# Altium schematic sheet 无线门禁系统.SchDoc
size A2
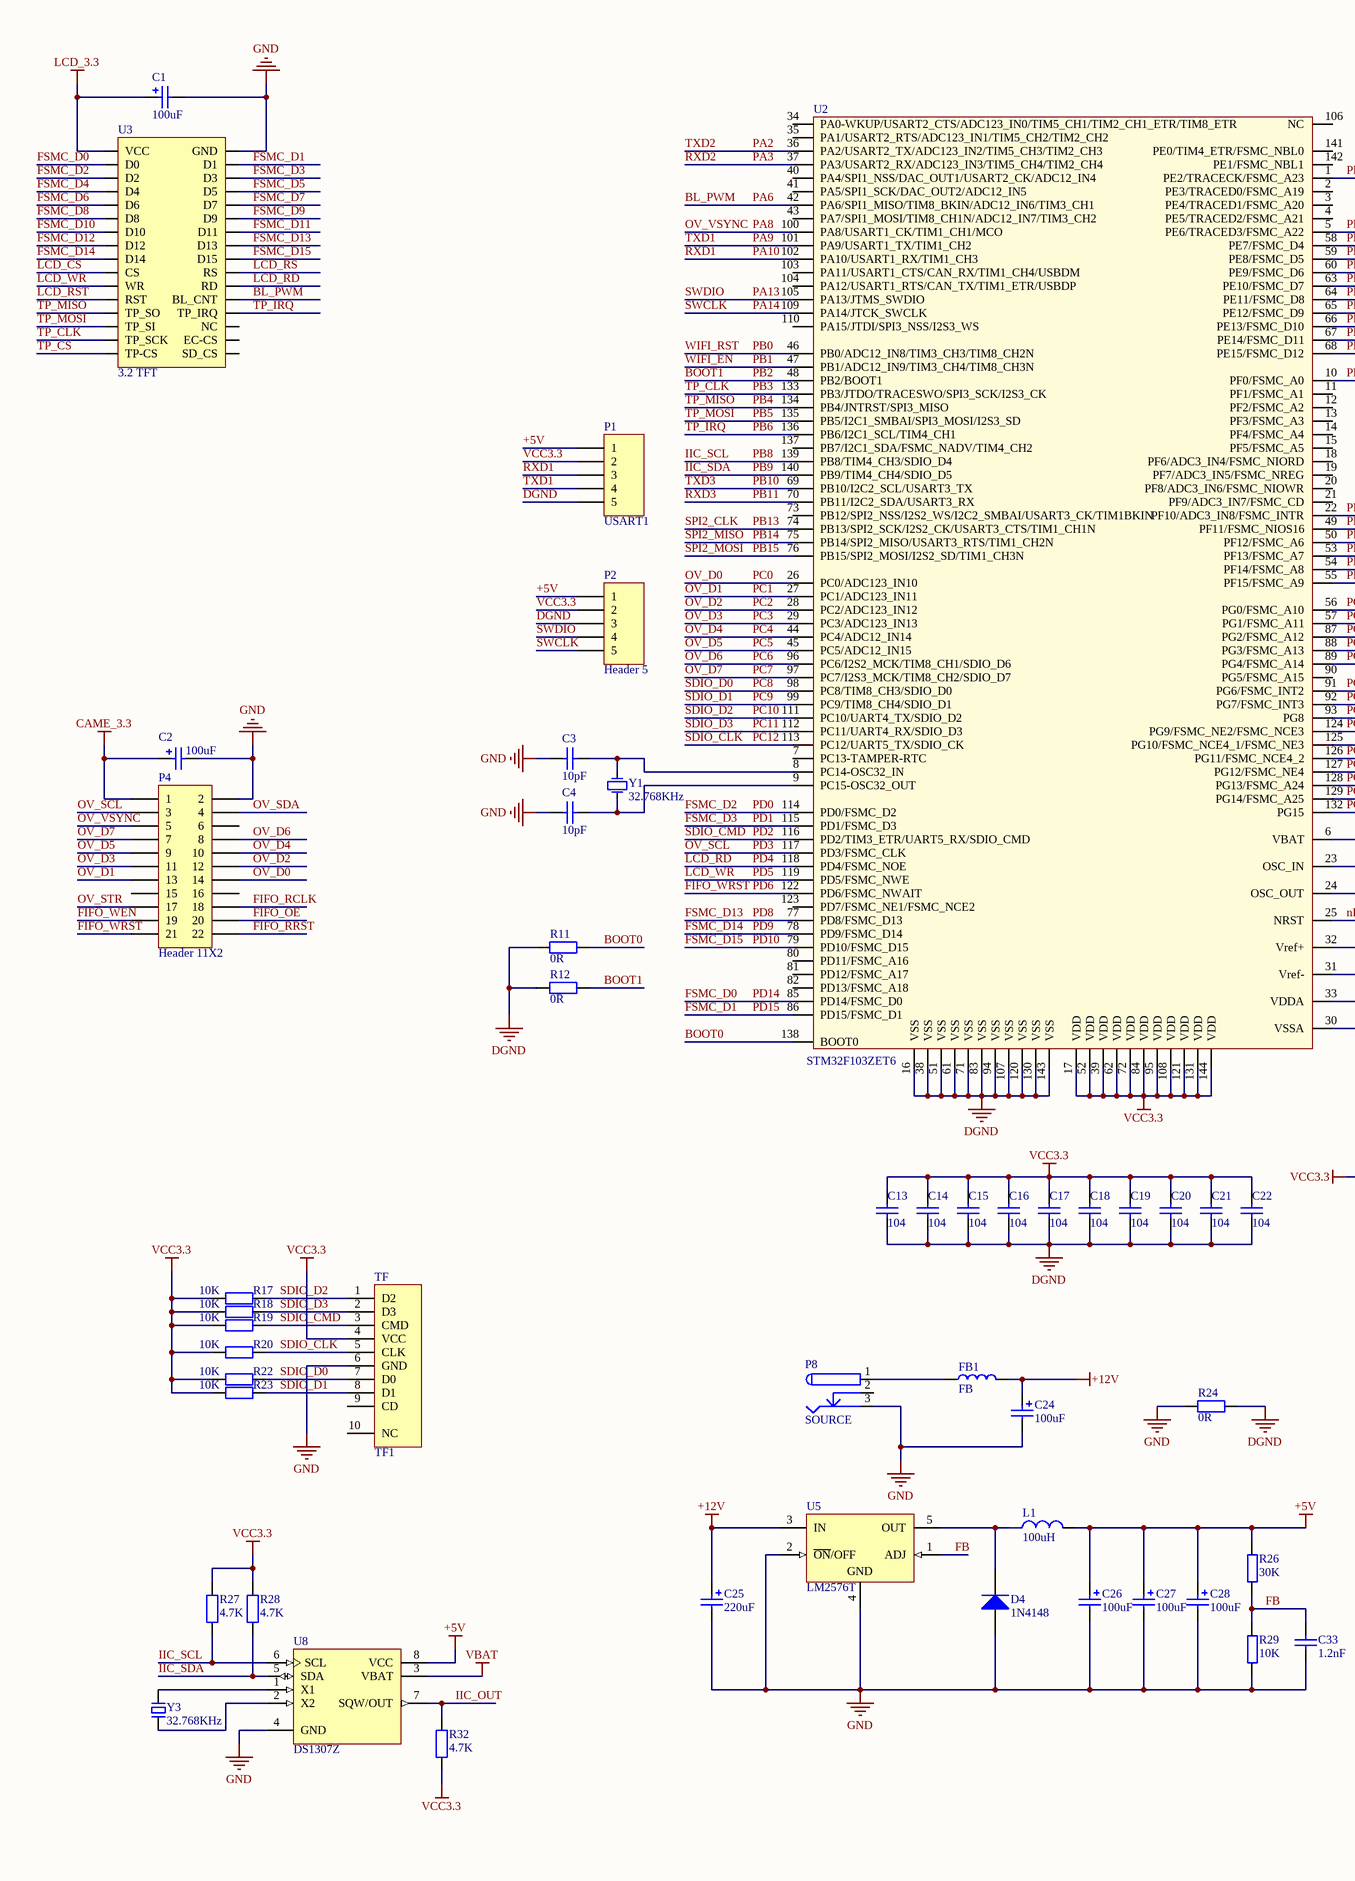
[diagram p0: 无线门禁系统.SchDoc, left]
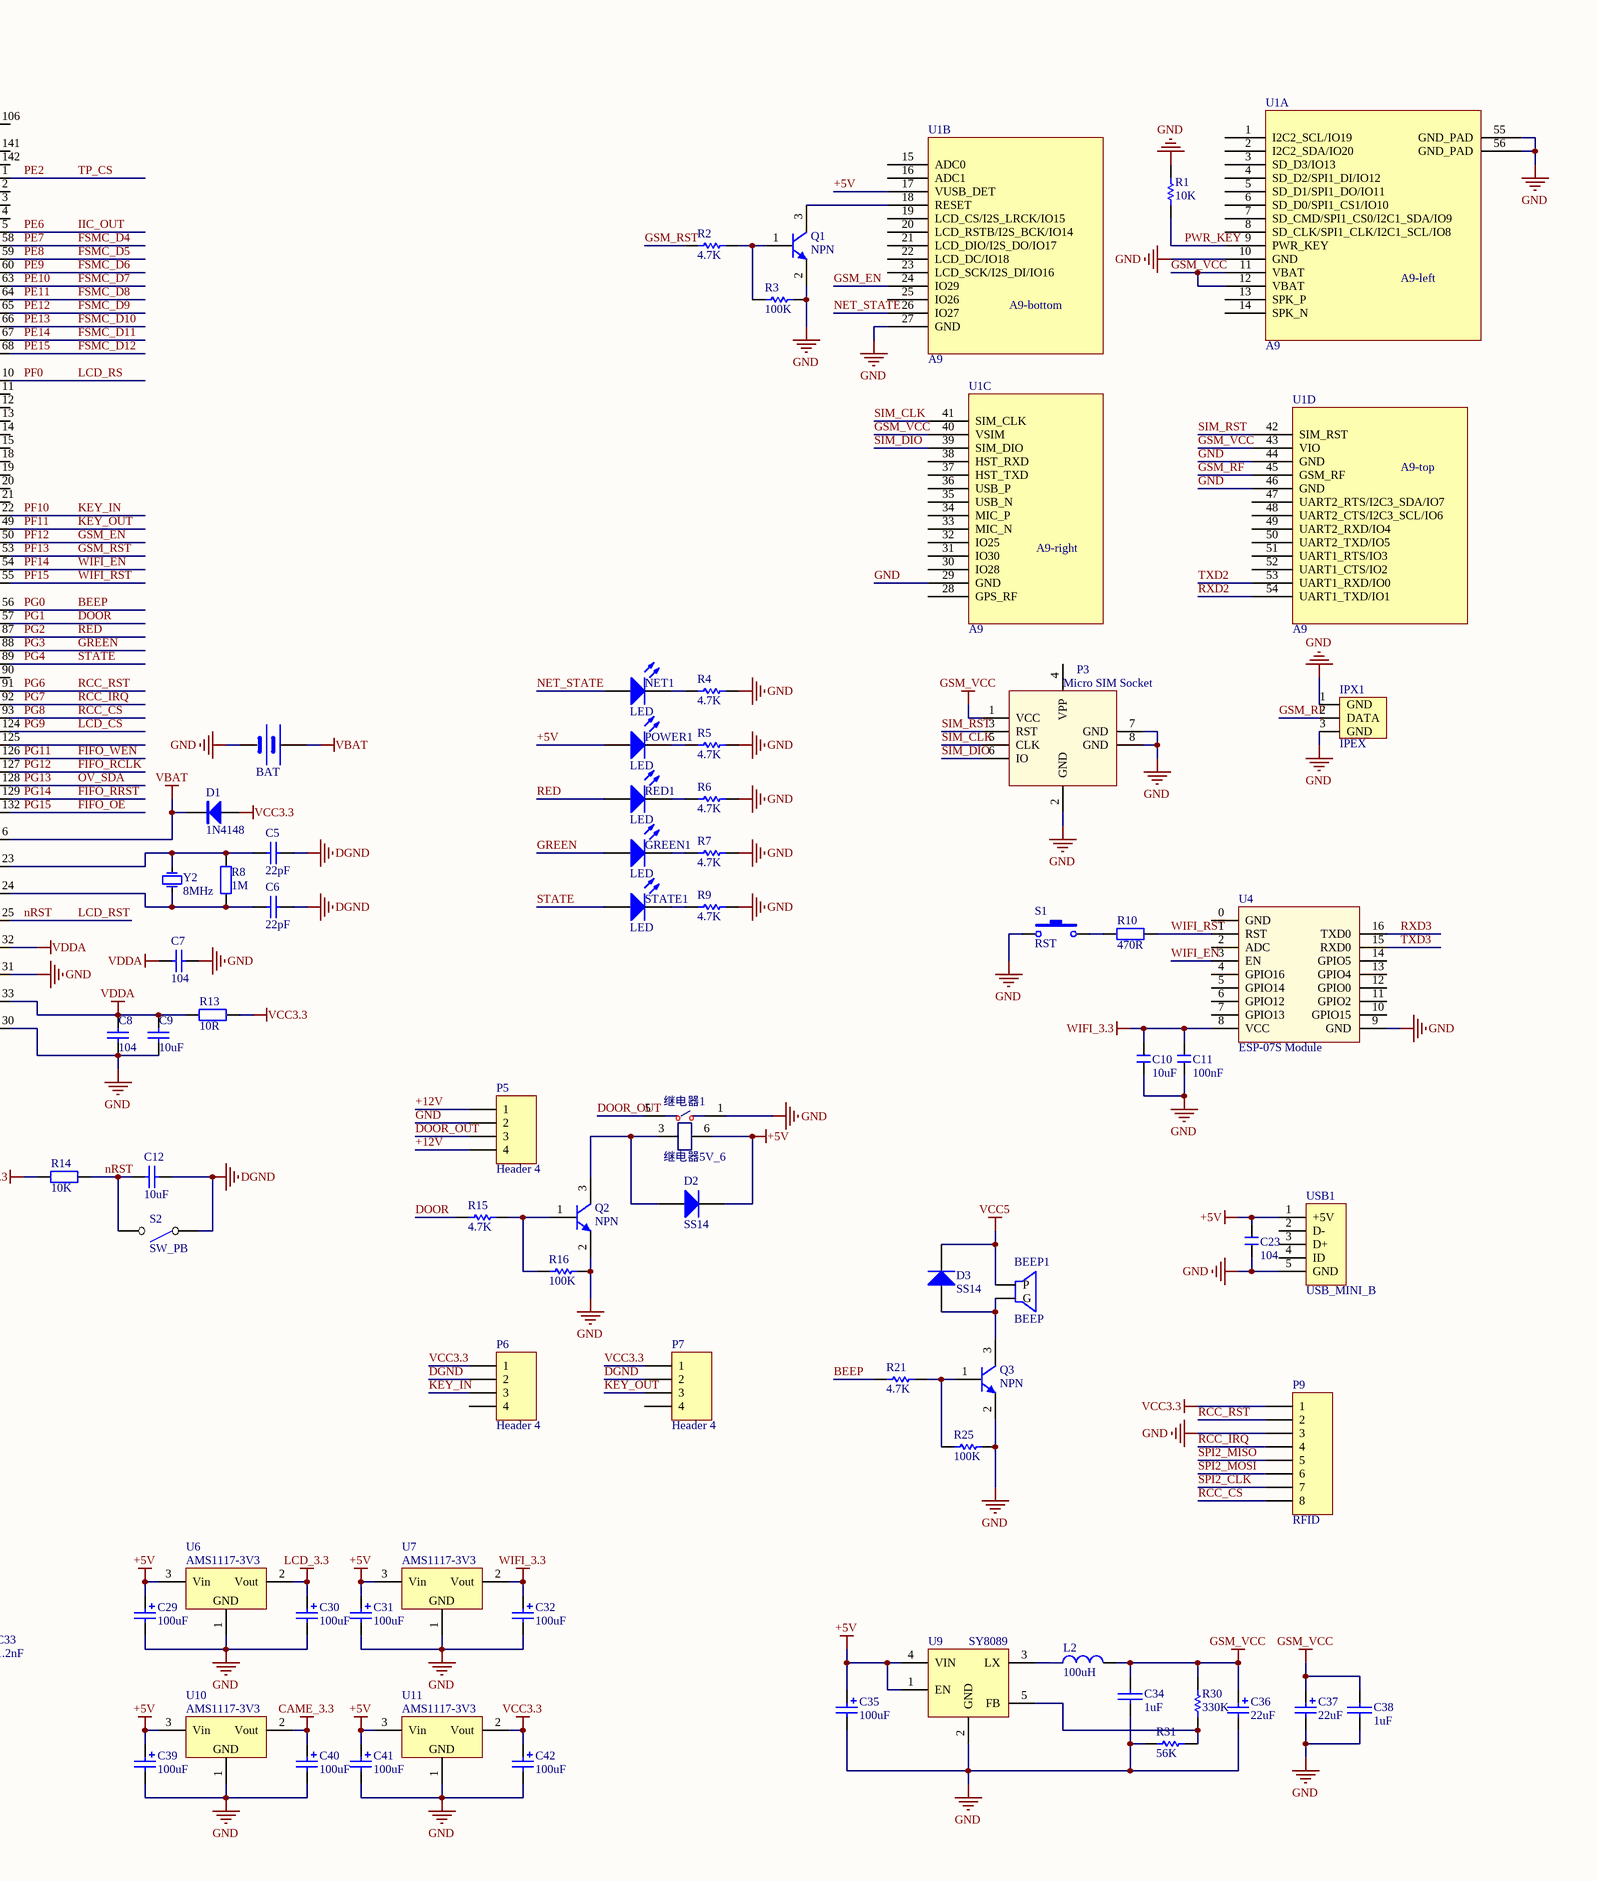
[diagram p1: 无线门禁系统.SchDoc, right]

## Parts
BAT  BATT  [纽扣电池座CR1220]  (value not drawn)
BEEP1  BEEP  [BUZZER]
C1  value 100uF  [CAP_TAN_B_3518]  (hidden comment: Cap Pol SMT D)
C2  value 100uF  [CAP_TAN_B_3518]  (hidden comment: Cap Pol SMT D)
C3  value 10pF  [0805_c]  (hidden comment: Cap1)
C4  value 10pF  [0805_c]  (hidden comment: Cap1)
C5  value 22pF  [0805_c]  (hidden comment: Cap1)
C6  value 22pF  [0805_c]  (hidden comment: Cap1)
C7  value 104  [0805_c]  (hidden comment: Cap1)
C8  value 104  [0805_c]  (hidden comment: Cap1)
C9  value 10uF  [0805_c]  (hidden comment: Cap1)
C10  10uF  [0805_c]
C11  100nF  [0805_c]
C12  value 10uF  [0805_c]  (hidden comment: Cap1)
C13  value 104  [0805_c]  (hidden comment: Cap1)
C14  value 104  [0805_c]  (hidden comment: Cap1)
C15  value 104  [0805_c]  (hidden comment: Cap1)
C16  value 104  [0805_c]  (hidden comment: Cap1)
C17  value 104  [0805_c]  (hidden comment: Cap1)
C18  value 104  [0805_c]  (hidden comment: Cap1)
C19  value 104  [0805_c]  (hidden comment: Cap1)
C20  value 104  [0805_c]  (hidden comment: Cap1)
C21  value 104  [0805_c]  (hidden comment: Cap1)
C22  value 104  [0805_c]  (hidden comment: Cap1)
C23  104  [0805_c]
C24  value 100uF  [CAP_TAN_B_3518]  (hidden comment: Cap Tan A)
C25  value 220uF  [CAP_TAN_B_3518]  (hidden comment: Cap Electrolytic)
C26  value 100uF  [CAP_TAN_B_3518]  (hidden comment: Cap Tan A)
C27  value 100uF  [CAP_TAN_B_3518]  (hidden comment: Cap Tan A)
C28  value 100uF  [CAP_TAN_B_3518]  (hidden comment: Cap Tan A)
C29  value 100uF  [CAP_TAN_B_3518]  (hidden comment: Cap Pol SMT D)
C30  value 100uF  [CAP_TAN_B_3518]  (hidden comment: Cap Pol SMT D)
C31  value 100uF  [CAP_TAN_B_3518]  (hidden comment: Cap Pol SMT D)
C32  value 100uF  [CAP_TAN_B_3518]  (hidden comment: Cap Pol SMT D)
C33  value 1.2nF  [0805_c]  (hidden comment: Cap Chip 0805)
C34  1uF  [0805_c]
C35  value 100uF  [CAP_TAN_B_3518]  (hidden comment: Cap Pol SMT D)
C36  value 22uF  [CAP_TAN_B_3518]  (hidden comment: Cap Pol SMT D)
C37  value 22uF  [CAP_TAN_B_3518]  (hidden comment: Cap Pol SMT D)
C38  1uF  [0805_c]
C39  value 100uF  [CAP_TAN_B_3518]  (hidden comment: Cap Pol SMT D)
C40  value 100uF  [CAP_TAN_B_3518]  (hidden comment: Cap Pol SMT D)
C41  value 100uF  [CAP_TAN_B_3518]  (hidden comment: Cap Pol SMT D)
C42  value 100uF  [CAP_TAN_B_3518]  (hidden comment: Cap Pol SMT D)
D1  1N4148  [DIODE SMC]
D2  SS14  [DIODE SMC]
D3  SS14  [DIODE SMC]
D4  1N4148  [DIODE SMC]
FB1  FB  [FU 1206]
GREEN1  LED  [0805_LED]
IPX1  IPEX  [IPEX]
L1  100uH  [L_3]
L2  100uH  [L_3]
NET1  LED  [0805_LED]
P1  USART1  [HX2.54-5]
P2  Header 5  [HX2.54-5]
P3  Micro SIM Socket  [SIM_micro]
P4  Header 11X2  [HDR2X11]
P5  Header 4  [HX2.54-4]
P6  Header 4  [HX2.54-4]
P7  Header 4  [HX2.54-4]
P8  SOURCE  [source]
P9  RFID  [HX2.54-8]
POWER1  LED  [0805_LED]
Q1  NPN  [SOT-23-3]
Q2  NPN  [SOT-23-3]
Q3  NPN  [SOT-23-3]
R1  10K  [0805_r]
R2  4.7K  [0805_r]
R3  100K  [0805_r]
R4  4.7K  [0805_r]
R5  4.7K  [0805_r]
R6  4.7K  [0805_r]
R7  4.7K  [0805_r]
R8  value 1M  [0805_r]  (hidden comment: Res1)
R9  4.7K  [0805_r]
R10  value 470R  [0805_r]  (hidden comment: Res1)
R11  value 0R  [0805_r]  (hidden comment: Res1)
R12  value 0R  [0805_r]  (hidden comment: Res1)
R13  value 10R  [0805_r]  (hidden comment: Res1)
R14  value 10K  [0805_r]  (hidden comment: Res1)
R15  4.7K  [0805_r]
R16  100K  [0805_r]
R17  10K  [0805_r]
R18  10K  [0805_r]
R19  10K  [0805_r]
R20  10K  [0805_r]
R21  4.7K  [0805_r]
R22  10K  [0805_r]
R23  10K  [0805_r]
R24  value 0R  [0805_r]  (hidden comment: Res1)
R25  100K  [0805_r]
R26  30K  [0805_r]
R27  4.7K  [0805_r]
R28  4.7K  [0805_r]
R29  10K  [0805_r]
R30  330K  [0805_r]
R31  56K  [0805_r]
R32  4.7K  [0805_r]
RED1  LED  [0805_LED]
S1  RST  [KEY_2]
S2  SW_PB  [KEY_2]
STATE1  LED  [0805_LED]
TF1  TF  [TF-2]
U1  A9  [A9]  (parts A,B,C,D of 4)
U2  STM32F103ZET6  [TQFP144_L]
U3  3.2 TFT  [LCD3.2]
U4  ESP-07S Module  [ESP-07S Module]
U5  LM2576T  [TO-263-5]
U6  AMS1117-3V3  [SOT-223]
U7  AMS1117-3V3  [SOT-223]
U8  DS1307Z  [SOIC8_L]
U9  SY8089  [SOP-5N]
U10  AMS1117-3V3  [SOT-223]
U11  AMS1117-3V3  [SOT-223]
USB1  USB_MINI_B  [USB-MICRO_B]
Y1  32.768KHz  [XTAL-2]
Y2  8MHz  [XTAL-49S SMD - L]
Y3  32.768KHz  [XTAL-2]
继电器1  继电器5V_6  [继电器5V_6]

## Nets
+5V: C23.2 C26.2 C27.2 C28.2 C29.1 C31.1 C35.1 C39.1 C41.1 D2.2(K) L1.1 P1.1 P2.1 POWER1.1(A) R26.2 U1.17(VUSB_DET) U6.3(Vin) U7.3(Vin) U8.8(VCC) U9.1(EN) U9.4(VIN) U10.3(Vin) U11.3(Vin) USB1.1(+5V) 继电器1.6(FLA)
+12V: C24.2 C25.1 FB1.2 P5.1 P5.4 U5.3(IN)
CAME_3.3: C2.1 C40.1 P4.1 U10.2(Vout)
DGND: C5.1 C6.1 C12.1 C13.1 C14.1 C15.1 C16.1 C17.1 C18.1 C19.1 C20.1 C21.1 C22.1 P1.5 P2.3 P6.2 P7.2 R11.2 R12.2 R24.1 S2.1 U2.16(VSS) U2.38(VSS) U2.51(VSS) U2.61(VSS) U2.71(VSS) U2.83(VSS) U2.94(VSS) U2.107(VSS) U2.120(VSS) U2.130(VSS) U2.143(VSS)
GND: BAT.2(GND) C1.2 C2.2 C3.1 C4.1 C7.1 C8.1 C9.1 C10.1 C11.1 C23.1 C24.1 C25.2 C26.1 C27.1 C28.1 C29.2 C30.2 C31.2 C32.2 C33.1 C34.1 C35.2 C36.2 C37.2 C38.1 C39.2 C40.2 C41.2 C42.2 D4.1(A) IPX1.1(GND) IPX1.3(GND) P3.2(GND) P3.7(GND) P3.8(GND) P4.2 P5.2 P8.3 P9.3 Q1.2(E) Q2.2(E) Q3.2(E) R1.2 R3.2 R4.2 R5.2 R6.2 R7.2 R9.2 R16.2 R24.2 R25.2 R29.1 R31.1 S1.2 TF1.6(GND) U1.10(GND) U1.27(GND) U1.29(GND) U1.44(GND) U1.46(GND) U1.55(GND_PAD) U1.56(GND_PAD) U2.30(VSSA) U2.31(Vref-) U3.2(GND) U4.9(GND) U5.2(~{ON}/OFF) U5.4(GND) U6.1(GND) U7.1(GND) U8.4(GND) U9.2(GND) U10.1(GND) U11.1(GND) USB1.5(GND) 继电器1.1(FLB)
GSM_VCC: C34.2 C36.1 C37.1 C38.2 L2.1 P3.1(VCC) R30.2 U1.11(VBAT) U1.12(VBAT) U1.40(VSIM) U1.43(VIO)
LCD_3.3: C1.1 C30.1 U3.1(VCC) U6.2(Vout)
VBAT: BAT.1(VCC) D1.2(K) U2.6(VBAT) U8.3(VBAT)
VCC3.3: C13.2 C14.2 C15.2 C16.2 C17.2 C18.2 C19.2 C20.2 C21.2 C22.2 C42.1 D1.1(A) P1.2 P2.2 P6.1 P7.1 P9.1 R13.2 R14.2 R17.1 R18.1 R19.1 R20.1 R22.1 R23.1 R27.2 R28.2 R32.1 TF1.4(VCC) U2.17(VDD) U2.39(VDD) U2.52(VDD) U2.62(VDD) U2.72(VDD) U2.84(VDD) U2.95(VDD) U2.108(VDD) U2.121(VDD) U2.131(VDD) U2.144(VDD) U11.2(Vout)
VCC5: BEEP1.1(P) D3.2(K)
VDDA: C7.2 C8.2 C9.2 R13.1 U2.32(Vref+) U2.33(VDDA)
WIFI_3.3: C10.2 C11.2 C32.1 U4.8(VCC) U7.2(Vout)
BEEP: R21.1 U2.56(PG0/FSMC_A10)  [also labelled PG0]
BL_PWM: U2.42(PA6/SPI1_MISO/TIM8_BKIN/ADC12_IN6/TIM3_CH1) U3.24(BL_CNT)  [also labelled PA6]
BOOT0: R11.1 U2.138(BOOT0)
BOOT1: R12.1 U2.48(PB2/BOOT1)  [also labelled PB2]
DOOR: R15.1 U2.57(PG1/FSMC_A11)  [also labelled PG1]
DOOR_OUT: P5.3 继电器1.5(FLA)
FB: C33.2 R26.1 R29.2 U5.1(ADJ)
FIFO_OE: P4.20 U2.132(PG15)  [also labelled PG15]
FIFO_RCLK: P4.18 U2.127(PG12/FSMC_NE4)  [also labelled PG12]
FIFO_RRST: P4.22 U2.129(PG14/FSMC_A25)  [also labelled PG14]
FIFO_WEN: P4.19 U2.126(PG11/FSMC_NCE4_2)  [also labelled PG11]
FIFO_WRST: P4.21 U2.122(PD6/FSMC_NWAIT)  [also labelled PD6]
FSMC_D0: U2.85(PD14/FSMC_D0) U3.3(D0)  [also labelled PD14]
FSMC_D1: U2.86(PD15/FSMC_D1) U3.4(D1)  [also labelled PD15]
FSMC_D2: U2.114(PD0/FSMC_D2) U3.5(D2)  [also labelled PD0]
FSMC_D3: U2.115(PD1/FSMC_D3) U3.6(D3)  [also labelled PD1]
FSMC_D4: U2.58(PE7/FSMC_D4) U3.7(D4)  [also labelled PE7]
FSMC_D5: U2.59(PE8/FSMC_D5) U3.8(D5)  [also labelled PE8]
FSMC_D6: U2.60(PE9/FSMC_D6) U3.9(D6)  [also labelled PE9]
FSMC_D7: U2.63(PE10/FSMC_D7) U3.10(D7)  [also labelled PE10]
FSMC_D8: U2.64(PE11/FSMC_D8) U3.11(D8)  [also labelled PE11]
FSMC_D9: U2.65(PE12/FSMC_D9) U3.12(D9)  [also labelled PE12]
FSMC_D10: U2.66(PE13/FSMC_D10) U3.13(D10)  [also labelled PE13]
FSMC_D11: U2.67(PE14/FSMC_D11) U3.14(D11)  [also labelled PE14]
FSMC_D12: U2.68(PE15/FSMC_D12) U3.15(D12)  [also labelled PE15]
FSMC_D13: U2.77(PD8/FSMC_D13) U3.16(D13)  [also labelled PD8]
FSMC_D14: U2.78(PD9/FSMC_D14) U3.17(D14)  [also labelled PD9]
FSMC_D15: U2.79(PD10/FSMC_D15) U3.18(D15)  [also labelled PD10]
GREEN: GREEN1.1(A) U2.88(PG3/FSMC_A13)  [also labelled PG3]
GSM_EN: U1.24(IO29) U2.50(PF12/FSMC_A6)  [also labelled PF12]
GSM_RF: IPX1.2(DATA) U1.45(GSM_RF)
GSM_RST: R2.1 U2.53(PF13/FSMC_A7)  [also labelled PF13]
IIC_OUT: R32.2 U2.5(PE6/TRACED3/FSMC_A22) U8.7(SQW/OUT)  [also labelled PE6]
IIC_SCL: R27.1 U2.139(PB8/TIM4_CH3/SDIO_D4) U8.6(SCL)  [also labelled PB8]
IIC_SDA: R28.1 U2.140(PB9/TIM4_CH4/SDIO_D5) U8.5(SDA)  [also labelled PB9]
KEY_IN: P6.3 U2.22(PF10/ADC3_IN8/FSMC_INTR)  [also labelled PF10]
KEY_OUT: P7.3 U2.49(PF11/FSMC_NIOS16)  [also labelled PF11]
LCD_CS: U2.124(PG9/FSMC_NE2/FSMC_NCE3) U3.19(CS)  [also labelled PG9]
LCD_RD: U2.118(PD4/FSMC_NOE) U3.22(RD)  [also labelled PD4]
LCD_RS: U2.10(PF0/FSMC_A0) U3.20(RS)  [also labelled PF0]
LCD_RST: C12.2 R14.1 S2.2 U2.25(NRST) U3.23(RST)  [also labelled nRST]
LCD_WR: U2.119(PD5/FSMC_NWE) U3.21(WR)  [also labelled PD5]
NET_STATE: NET1.1(A) U1.26(IO27)
OV_D0: P4.14 U2.26(PC0/ADC123_IN10)  [also labelled PC0]
OV_D1: P4.13 U2.27(PC1/ADC123_IN11)  [also labelled PC1]
OV_D2: P4.12 U2.28(PC2/ADC123_IN12)  [also labelled PC2]
OV_D3: P4.11 U2.29(PC3/ADC123_IN13)  [also labelled PC3]
OV_D4: P4.10 U2.44(PC4/ADC12_IN14)  [also labelled PC4]
OV_D5: P4.9 U2.45(PC5/ADC12_IN15)  [also labelled PC5]
OV_D6: P4.8 U2.96(PC6/I2S2_MCK/TIM8_CH1/SDIO_D6)  [also labelled PC6]
OV_D7: P4.7 U2.97(PC7/I2S3_MCK/TIM8_CH2/SDIO_D7)  [also labelled PC7]
OV_SCL: P4.3 U2.117(PD3/FSMC_CLK)  [also labelled PD3]
OV_SDA: P4.4 U2.128(PG13/FSMC_A24)  [also labelled PG13]
OV_STR: P4.17
OV_VSYNC: P4.5 U2.100(PA8/USART1_CK/TIM1_CH1/MCO)  [also labelled PA8]
PA2: U1.53(UART1_RXD/IO0) U2.36(PA2/USART2_TX/ADC123_IN2/TIM5_CH3/TIM2_CH3)  [also labelled TXD2]
PA3: U1.54(UART1_TXD/IO1) U2.37(PA3/USART2_RX/ADC123_IN3/TIM5_CH4/TIM2_CH4)  [also labelled RXD2]
PA9: P1.4 U2.101(PA9/USART1_TX/TIM1_CH2)  [also labelled TXD1]
PA10: P1.3 U2.102(PA10/USART1_RX/TIM1_CH3)  [also labelled RXD1]
PA13: P2.4 U2.105(PA13/JTMS_SWDIO)  [also labelled SWDIO]
PA14: P2.5 U2.109(PA14/JTCK_SWCLK)  [also labelled SWCLK]
PB0: R10.1 U2.46(PB0/ADC12_IN8/TIM3_CH3/TIM8_CH2N) U2.55(PF15/FSMC_A9) U4.1(RST)  [also labelled PF15, WIFI_RST]
PB1: U2.47(PB1/ADC12_IN9/TIM3_CH4/TIM8_CH3N) U2.54(PF14/FSMC_A8) U4.3(EN)  [also labelled PF14, WIFI_EN]
PB3: U2.133(PB3/JTDO/TRACESWO/SPI3_SCK/I2S3_CK) U3.29(TP_SCK)  [also labelled TP_CLK]
PB4: U2.134(PB4/JNTRST/SPI3_MISO) U3.25(TP_SO)  [also labelled TP_MISO]
PB5: U2.135(PB5/I2C1_SMBAI/SPI3_MOSI/I2S3_SD) U3.27(TP_SI)  [also labelled TP_MOSI]
PB6: U2.136(PB6/I2C1_SCL/TIM4_CH1) U3.26(TP_IRQ)  [also labelled TP_IRQ]
PB10: U2.69(PB10/I2C2_SCL/USART3_TX) U4.15(RXD0)  [also labelled TXD3]
PB11: U2.70(PB11/I2C2_SDA/USART3_RX) U4.16(TXD0)  [also labelled RXD3]
PB13: P9.7 U2.74(PB13/SPI2_SCK/I2S2_CK/USART3_CTS/TIM1_CH1N)  [also labelled SPI2_CLK]
PB14: P9.5 U2.75(PB14/SPI2_MISO/USART3_RTS/TIM1_CH2N)  [also labelled SPI2_MISO]
PB15: P9.6 U2.76(PB15/SPI2_MOSI/I2S2_SD/TIM1_CH3N)  [also labelled SPI2_MOSI]
PC8: R22.2 TF1.7(D0) U2.98(PC8/TIM8_CH3/SDIO_D0)  [also labelled SDIO_D0]
PC9: R23.2 TF1.8(D1) U2.99(PC9/TIM8_CH4/SDIO_D1)  [also labelled SDIO_D1]
PC10: R17.2 TF1.1(D2) U2.111(PC10/UART4_TX/SDIO_D2)  [also labelled SDIO_D2]
PC11: R18.2 TF1.2(D3) U2.112(PC11/UART4_RX/SDIO_D3)  [also labelled SDIO_D3]
PC12: R20.2 TF1.5(CLK) U2.113(PC12/UART5_TX/SDIO_CK)  [also labelled SDIO_CLK]
PD2: R19.2 TF1.3(CMD) U2.116(PD2/TIM3_ETR/UART5_RX/SDIO_CMD)  [also labelled SDIO_CMD]
PE2: U2.1(PE2/TRACECK/FSMC_A23) U3.31(TP-CS)  [also labelled TP_CS]
PG2: RED1.1(A) U2.87(PG2/FSMC_A12)  [also labelled RED]
PG4: STATE1.1(A) U2.89(PG4/FSMC_A14)  [also labelled STATE]
PG6: P9.2 U2.91(PG6/FSMC_INT2)  [also labelled RCC_RST]
PG7: P9.4 U2.92(PG7/FSMC_INT3)  [also labelled RCC_IRQ]
PG8: P9.8 U2.93(PG8)  [also labelled RCC_CS]
PWR_KEY: R1.1 U1.9(PWR_KEY)
SIM_CLK: P3.5(CLK) U1.41(SIM_CLK)
SIM_DIO: P3.6(IO) U1.39(SIM_DIO)
SIM_RST: P3.3(RST) U1.42(SIM_RST)
NetBEEP1_2: BEEP1.2(G) D3.1(A) Q3.3(C)
NetC3_2: C3.2 U2.8(PC14-OSC32_IN) Y1.2(OSC2)
NetC4_2: C4.2 U2.9(PC15-OSC32_OUT) Y1.1(OSC1)
NetC5_2: C5.2 R8.2 U2.23(OSC_IN) Y2.2(OSC2)
NetC6_2: C6.2 R8.1 U2.24(OSC_OUT) Y2.1(OSC1)
NetD2_1: D2.1(A) Q2.3(C) 继电器1.3(FLA)
NetD4_2: D4.2(K) L1.2 U5.5(OUT)
NetFB1_1: FB1.1 P8.1
NetGREEN1_2: GREEN1.2(K) R7.1
NetL2_2: L2.2 U9.3(LX)
NetNET1_2: NET1.2(K) R4.1
NetPOWER1_2: POWER1.2(K) R5.1
NetQ1_1: Q1.1(B) R2.2 R3.1
NetQ1_3: Q1.3(C) U1.18(RESET)
NetQ2_1: Q2.1(B) R15.2 R16.1
NetQ3_1: Q3.1(B) R21.2 R25.1
NetR6_1: R6.1 RED1.2(K)
NetR9_1: R9.1 STATE1.2(K)
NetR10_2: R10.2 S1.1
NetR30_1: R30.1 R31.2 U9.5(FB)
NetU8_1: U8.1(X1) Y3.2
NetU8_2: U8.2(X2) Y3.1

Not connected (* = marked no-connect by the designer): P3 4(VPP); P4 6 15 16; P6 4; P7 4; P8 2; TF1 9(CD) 10(NC); U1 1(I2C2_SCL/IO19) 2(I2C2_SDA/IO20) 3(SD_D3/IO13) 4(SD_D2/SPI1_DI/IO12) 5(SD_D1/SPI1_DO/IO11) 6(SD_D0/SPI1_CS1/IO10) 7(SD_CMD/SPI1_CS0/I2C1_SDA/IO9) 8(SD_CLK/SPI1_CLK/I2C1_SCL/IO8) 13(SPK_P) 14(SPK_N) 15(ADC0) 16(ADC1) 19(LCD_CS/I2S_LRCK/IO15) 20(LCD_RSTB/I2S_BCK/IO14) 21(LCD_DIO/I2S_DO/IO17) 22(LCD_DC/IO18) 23(LCD_SCK/I2S_DI/IO16) 25(IO26) 28(GPS_RF) 30(IO28) 31(IO30) 32(IO25) 33(MIC_N) 34(MIC_P) 35(USB_N) 36(USB_P) 37(HST_TXD) 38(HST_RXD) 47(UART2_RTS/I2C3_SDA/IO7) 48(UART2_CTS/I2C3_SCL/IO6) 49(UART2_RXD/IO4) 50(UART2_TXD/IO5) 51(UART1_RTS/IO3) 52(UART1_CTS/IO2); U2 2(PE3/TRACED0/FSMC_A19) 3(PE4/TRACED1/FSMC_A20) 4(PE5/TRACED2/FSMC_A21) 7(PC13-TAMPER-RTC) 11(PF1/FSMC_A1) 12(PF2/FSMC_A2) 13(PF3/FSMC_A3) 14(PF4/FSMC_A4) 15(PF5/FSMC_A5) 18(PF6/ADC3_IN4/FSMC_NIORD) 19(PF7/ADC3_IN5/FSMC_NREG) 20(PF8/ADC3_IN6/FSMC_NIOWR) 21(PF9/ADC3_IN7/FSMC_CD) 34(PA0-WKUP/USART2_CTS/ADC123_IN0/TIM5_CH1/TIM2_CH1_ETR/TIM8_ETR) 35(PA1/USART2_RTS/ADC123_IN1/TIM5_CH2/TIM2_CH2) 40(PA4/SPI1_NSS/DAC_OUT1/USART2_CK/ADC12_IN4) 41(PA5/SPI1_SCK/DAC_OUT2/ADC12_IN5) 43(PA7/SPI1_MOSI/TIM8_CH1N/ADC12_IN7/TIM3_CH2) 73(PB12/SPI2_NSS/I2S2_WS/I2C2_SMBAI/USART3_CK/TIM1BKIN) 80(PD11/FSMC_A16) 81(PD12/FSMC_A17) 82(PD13/FSMC_A18) 90(PG5/FSMC_A15) 103(PA11/USART1_CTS/CAN_RX/TIM1_CH4/USBDM) 104(PA12/USART1_RTS/CAN_TX/TIM1_ETR/USBDP) 106(NC) 110(PA15/JTDI/SPI3_NSS/I2S3_WS) 123(PD7/FSMC_NE1/FSMC_NCE2) 125(PG10/FSMC_NCE4_1/FSMC_NE3) 137(PB7/I2C1_SDA/FSMC_NADV/TIM4_CH2) 141(PE0/TIM4_ETR/FSMC_NBL0) 142(PE1/FSMC_NBL1); U3 28(NC) 30(EC-CS) 32(SD_CS); U4 0(GND) 2(ADC) 4(GPIO16) 5(GPIO14) 6(GPIO12) 7(GPIO13) 10(GPIO15) 11(GPIO2) 12(GPIO0) 13(GPIO4) 14(GPIO5); USB1 2(D-) 3(D+) 4(ID)

## Notes on the sheet
- (in symbol A9, part A) A9-left
- (in symbol A9, part B) A9-bottom
- (in symbol A9, part C) A9-right
- (in symbol A9, part D) A9-top

## Library data of the parts
BAT = BAT
C1 C2 C29-C32 C35-C37 C39-C42 = Cap Pol SMT D: Polarized Capacitor (Radial); Voltage: 16V; Published: 8-Jun-2000; Revision: July-2002: Re-released for DXP Platform.; Publisher: Altium Limited
C3-C9 C12-C22 = Cap1: Capacitor; Published: 8-Jun-2000; LatestRevisionDate: 17-Jul-2002; LatestRevisionNote: Re-released for DXP Platform.; PackageReference: RAD-0.3; Publisher: Altium Limited
C10 C11 C23 = C: 无极性贴片电容; 版权归属: 源创客; BOM名称: 无极性贴片电容; 学习资源: www.ooocke.com
C24 C26-C28 = Cap Tan A: Polarized Capacitor (Radial); Voltage: 16V; Published: 8-Jun-2000; Revision: July-2002: Re-released for DXP Platform.; Publisher: Altium Limited
C25 = Cap Electrolytic: Polarized Capacitor (Radial); Published: 8-Jun-2000; LatestRevisionDate: 17-Jul-2002; LatestRevisionNote: Re-released for DXP Platform.; PackageReference: RB7.6-15; Publisher: Altium Limited; PackageDescription: Polarized Capacitor (Radial); 2 Leads
C33 = Cap Chip 0805: Polarized Capacitor (Radial); Published: 8-Jun-2000; Revision: July-2002: Re-released for DXP Platform.; Publisher: Altium Limited
C34 C38 = CAP
D1 = 1N4148: 高速开关二极管; 版权归属: 源创客; BOM名称: 高速开关二极管; 学习资源: www.ooocke.com
D2 D3 = 1N4148: High Conductance Fast Diode; Published: 8-Jun-2000; LatestRevisionDate: 17-Jul-2002; LatestRevisionNote: Re-released for DXP Platform.; DatasheetDocument: 1997; PackageReference: DO-35; Publisher: Altium Limited; Code_JEDEC: DO-204-AH; ComponentLink1Description: Manufacturer Link; ComponentLink1URL: http://www.fairchildsemi.com/; ComponentLink2Description: Datasheet; ComponentLink2URL: http://www.fairchildsemi.com/ds/1N%2F1N4448.pdf
D4 = Diode: 3 Amp Medium Power Silicon Rectifier Diode; Published: 8-Jun-2000; LatestRevisionDate: 17-Jul-2002; LatestRevisionNote: Re-released for DXP Platform.; DatasheetVersion: Aug-1984; PackageReference: DO-201AD; Publisher: Altium Limited; PackageDescription: Diode, Axial; Body 9.5 x 5.3 mm (LxDia. max), Lead Dia. 1.32 mm (max); ComponentLink1Description: Manufacturer Link; ComponentLink1URL: http://www.irf.com/
FB1 = FB: 磁珠
IPX1 = IPEX: IPEX座
L1 L2 = inductance
P1 P2 = Header 5: Header, 5-Pin; LatestRevisionDate: 17-Jul-2002; LatestRevisionNote: Re-released for DXP Platform.; Publisher: Altium Limited
P3 = Micro SIM
P4 = Header 11X2: Header, 11-Pin, Dual row; LatestRevisionDate: 17-Jul-2002; LatestRevisionNote: Re-released for DXP Platform.; Publisher: Altium Limited
P5-P7 = Header 4: Header, 4-Pin; LatestRevisionDate: 17-Jul-2002; LatestRevisionNote: Re-released for DXP Platform.; Publisher: Altium Limited
P9 = Header 8: Header, 8-Pin; LatestRevisionDate: 17-Jul-2002; LatestRevisionNote: Re-released for DXP Platform.; Publisher: Altium Limited
Q1-Q3 = NPN2: 贴片
R1-R7 R9 R15 R16 R21 R25 R30 R31 = RES: Resistor; Value: 1K; Published: 8-Jun-2000; Revision: July-2002: Re-released for DXP Platform.; Publisher: Altium Limited
R8 R10-R14 R24 = Res1: Resistor; Published: 8-Jun-2000; LatestRevisionDate: 17-Jul-2002; LatestRevisionNote: Re-released for DXP Platform.; PackageReference: AXIAL-0.4; Publisher: Altium Limited
R17-R20 R22 R23 R27 R28 R32 = R: 贴片电阻; 版权归属: 源创客; BOM名称: 贴片电阻; 学习资源: www.ooocke.com
R26 R29 = RES3
S1 = SW-PB: Switch; Published: 24-Mar-1999; LatestRevisionDate: 17-Jul-2002; LatestRevisionNote: Re-released for DXP Platform.; PackageReference: SPST-2; Publisher: Altium Limited; PackageDescription: Switch; 2 Leads
S2 = 单刀开关
TF1 = TF2
U3 = LCD3.2
U5 = LM2576T: Negative Low Dropout Adjustable Regulator; PartNumber: LM2991T; Manufacturer: National Semiconductor; CompType: LDO IC; PackageTopMarking: NSUZXYTTE#*LM2991T*P+; PowerWise: N; Published: 4-Dec-2008; DatasheetVersion: Sep-2000; PackageVersion: revJ, Jan-1992; PackageReference: T05A; Publisher: Altium Limited; PackageDescription: TO-220, Molded, 5 Lead, Straight; RoHS: O; PinCount: 5; DigiKeyPartNumber: LM2991T-ND; Code_JEDEC: TO-220-AB; ComponentLink1Description: LM2991 Datasheet; ComponentLink1URL: http://www.national.com/ds/LM/LM2991.pdf; ComponentLink2Description: LM2991 Web Page; ComponentLink2URL: http://www.national.com/pf/LM/LM2991.html; ComponentLink3Description: T05A Package Page; ComponentLink3URL: http://www.national.com/packaging/folders/t05a.html
U6 U7 U10 U11 = AMS1117: 三端稳压芯片; BOM名称: 稳压芯片; 版权归属: 源创客; 学习资源: www.ooocke.com
U8 = DS1307Z: 64 X 8 Serial Real-Time Clock; Published: 13-Oct-2000; LatestRevisionDate: 13-Apr-2006; LatestRevisionNote: IPC-7351 Footprint Added.; DatasheetVersion: 10-Aug-1999; PackageVersion: 1999; PackageReference: SOIC8N; Publisher: Altium Limited; PackageDescription: 8-Pin Small Outline Integrated Circuit 1.27 mm Pitch; Code_IPC: SOIC127P600-8; ComponentLink1Description: Manufacturer Link; ComponentLink1URL: http://www.maxim-ic.com/; ComponentLink2Description: Datasheet; ComponentLink2URL: http://pdfserv.maxim-ic.com/en/ds/DS1307.pdf; ComponentLink3Description: Discontinuation Notice; ComponentLink3URL: http://www.maxim-ic.com/qa/pdfs/non-obsolescence-letter.pdf
U9 = RT8059
USB1 = USB-5P: 微型USB母座; 版权归属: 源创客; BOM名称: 微型USB母座; 学习资源: www.ooocke.com
Y1 Y2 = XTAL: Crystal Oscillator; Published: 8-Jun-2000; LatestRevisionDate: 17-Jul-2002; LatestRevisionNote: Re-released for DXP Platform.; PackageReference: R38; Publisher: Altium Limited; PackageDescription: Crystal, Thru-Hole; 2 Leads; Body 3.1 x 8.2 mm (Dia.xH)
Y3 = XTAL-2: 2脚晶振; 版权归属: 源创客; BOM名称: 2脚晶振; 学习资源: www.ooocke.com
P8 = SOURCE: LatestRevisionDate: 17-Jul-2002; LatestRevisionNote: Re-released for DXP Platform.; Publisher: Altium Limited